# EAGLE design untitled (EAGLE 7.3.0)
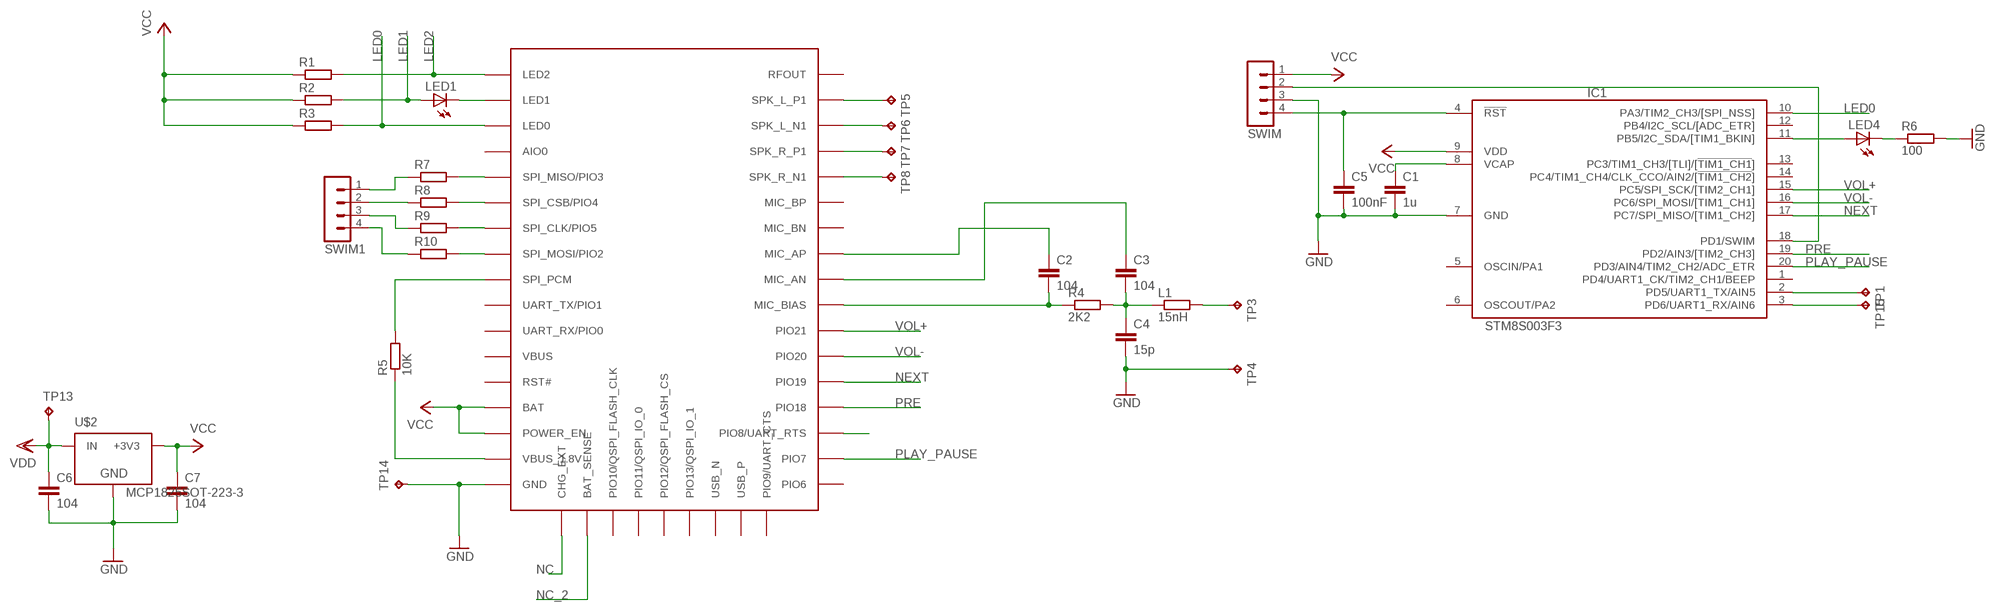
[diagram p0: schematic, sheet 1]

## Parts
C1  1u  C-EUC0805  [C0805]
C2  104  C-EUC0805  [C0805]
C3  104  C-EUC0805  [C0805]
C4  15p  C-EUC0805  [C0805]
C5  100nF  C-EUC0805  [C0805]
C6  104  C-EUC0805  [C0805]
C7  104  C-EUC0805  [C0805]
IC1  STM8S003F3  [TSSOP20]
L1  15nH  R-EU_R0603  [R0603]
LED1  LEDCHIPLED_0603  [CHIPLED_0603]
LED4  LEDCHIPLED_0603  [CHIPLED_0603]
R1  R-EU_R0805  [R0805]
R2  R-EU_R0805  [R0805]
R3  R-EU_R0805  [R0805]
R4  2K2  R-EU_R0805  [R0805]
R5  10K  R-EU_R0805  [R0805]
R6  100  R-EU_R0805  [R0805]
R7  R-EU_R0805  [R0805]
R8  R-EU_R0805  [R0805]
R9  R-EU_R0805  [R0805]
R10  R-EU_R0805  [R0805]
SWIM  MA04-1  [MA04-1]
SWIM1  MA04-1  [MA04-1]
TP1  TPB2,54  [B2,54]
TP3  TPB2,54  [B2,54]
TP4  TPB2,54  [B2,54]
TP5  TPB2,54  [B2,54]
TP6  TPB2,54  [B2,54]
TP7  TPB2,54  [B2,54]
TP8  TPB2,54  [B2,54]
TP13  TPB2,54  [B2,54]
TP14  TPB2,54  [B2,54]
TP15  TPB2,54  [B2,54]
U$1  F3188  [F3188]
U$2  MCP1825SOT-223-3  [SOT-223]

## Nets
GND: C1.2 C4.2 C5.2 C6.2 C7.2 IC1.7(GND) R6.2 SWIM.3 TP4.TP TP14.TP U$1.P$17(GND) U$2.2(GND)
LED0: IC1.10(PA3/TIM2_CH3/[SPI_NSS]) R3.2 U$1.P$3(LED0)
LED1: LED1.A R2.2
LED2: R1.2 U$1.P$1(LED2)
N$1: IC1.3(PD6/UART1_RX/AIN6) TP15.TP
N$5: IC1.2(PD5/UART1_TX/AIN5) TP1.TP
N$6: IC1.11(PB5/I2C_SDA/[TIM1_BKIN]) LED4.A
N$7: C2.2 R4.1 U$1.P$34(MIC_BIAS)
N$8: C3.2 C4.1 L1.1 R4.2
N$9: C3.1 U$1.P$35(MIC_AN)
N$10: C2.1 U$1.P$36(MIC_AP)
N$11: L1.2 TP3.TP
N$12: R5.1 U$1.P$16(VBUS_1.8V)
N$15: R5.2 U$1.P$9(SPI_PCM)
N$16: TP5.TP U$1.P$42(SPK_L_P1)
N$17: TP6.TP U$1.P$41(SPK_L_N1)
N$18: TP7.TP U$1.P$40(SPK_R_P1)
N$19: TP8.TP U$1.P$39(SPK_R_N1)
N$20: R7.2 U$1.P$5(SPI_MISO/PIO3)
N$21: R7.1 SWIM1.1
N$22: R9.2 U$1.P$7(SPI_CLK/PIO5)
N$23: R8.1 SWIM1.2
N$24: C1.1 IC1.8(VCAP)
N$26: C5.1 IC1.4(!RST) SWIM.4
N$27: U$1.P$29(PIO8/UART_RTS)
N$28: IC1.18(PD1/SWIM) SWIM.2
N$29: LED4.C R6.1
N$30: R8.2 U$1.P$6(SPI_CSB/PIO4)
N$31: R9.1 SWIM1.3
N$32: R10.2 U$1.P$8(SPI_MOSI/PIO2)
N$33: R10.1 SWIM1.4
N$34: LED1.C U$1.P$2(LED1)
NC: U$1.P$18(CHG_EXT)
NC_2: U$1.P$19(BAT_SENSE)
NEXT: IC1.17(PC7/SPI_MISO/[TIM1_CH2]) U$1.P$31(PIO19)
PLAY_PAUSE: IC1.20(PD3/AIN4/TIM2_CH2/ADC_ETR) U$1.P$28(PIO7)
PRE: IC1.19(PD2/AIN3/[TIM2_CH3]) U$1.P$30(PIO18)
VCC: C7.1 IC1.9(VDD) R1.1 R2.1 R3.1 SWIM.1 U$1.P$14(BAT) U$1.P$15(POWER_EN) U$2.3(+3V3)
VDD: C6.1 TP13.TP U$2.1(IN)
VOL+: IC1.15(PC5/SPI_SCK/[TIM2_CH1]) U$1.P$33(PIO21)
VOL-: IC1.16(PC6/SPI_MOSI/[TIM1_CH1]) U$1.P$32(PIO20)
Unconnected: IC1.1(PD4/UART1_CK/TIM2_CH1/BEEP) IC1.5(OSCIN/PA1) IC1.6(OSCOUT/PA2) IC1.12(PB4/I2C_SCL/[ADC_ETR]) IC1.13(PC3/TIM1_CH3/[TLI]/[!TIM1_CH1!]) IC1.14(PC4/TIM1_CH4/CLK_CCO/AIN2/[!TIM1_CH2!]) U$1.P$4(AIO0) U$1.P$10(UART_TX/PIO1) U$1.P$11(UART_RX/PIO0) U$1.P$13(RST#) U$1.P$20(PIO10/QSPI_FLASH_CLK) U$1.P$21(PIO11/QSPI_IO_0) U$1.P$22(PIO12/QSPI_FLASH_CS) U$1.P$23(PIO13/QSPI_IO_1) U$1.P$24(USB_N) U$1.P$25(USB_P) U$1.P$26(PIO9/UART_CTS) U$1.P$27(PIO6) U$1.P$37(MIC_BN) U$1.P$38(MIC_BP) U$1.P$43(RFOUT)

## Power pins joined to a net without a drawn wire
VBUS: U$1.P$12(VBUS)

## Library data of the parts
C1-C7 = rcl:C-EU: CAPACITOR, European symbol
IC1 = stm8:STM8S003: Value line, 16 MHz STM8S 8-bit MCU, 8 Kbytes Flash, 128 bytes data EEPROM, 10-bit ADC, 3 timers, UART, SPI, I2C
L1 R1-R10 = rcl:R-EU_: RESISTOR, European symbol
LED1 LED4 = led:LED: LED OSRAM: - CHIPLED LG R971, LG N971, LY N971, LG Q971, LY Q971, LO R971, LY R971 LH N974, LH R974 LS Q976, LO Q976, LY Q976 LO Q996 - Hyper CHIPLED LW Q18S LB Q993, LB Q99A, LB R99A - SideLED LS A670, LO A670, LY A670, LG A670, LP A670 LB A673, LV A673, LT A673, LW A673 LH A674 LY A675 LS A676, LA A676, LO A676, LY A676, LW A676 LS A679, LY A679, LG A679 - Hyper Micro SIDELED® LS Y876, LA Y876, LO Y876, LY Y876 LT Y87S - SmartLED LW L88C, LW L88S LB L89C, LB L89S, LG L890 LS L89K, LO L89K, LY L89K LS L896, LA L896, LO L896, LY L896 - TOPLED LS T670, LO T670, LY T670, LG T670, LP T670 LSG T670, LSP T670, LSY T670, LOP T670, LYG T670 LG T671, LOG T671, LSG T671 LB T673, LV T673, LT T673, LW T673 LH T674 LS T676, LA T676, LO T676, LY T676, LB T676, LH T676, LSB T676, LW T676 LB T67C, LV T67C, LT T67C, LS T67K, LO T67K, LY T67K, LW E67C LS E67B, LA E67B, LO E67B, LY E67B, LB E67C, LV E67C, LT E67C LW T67C LS T679, LY T679, LG T679 LS T770, LO T770, LY T770, LG T770, LP T770 LB T773, LV T773, LT T773, LW T773 LH T774 LS E675, LA E675, LY E675, LS T675 LS T776, LA T776, LO T776, LY T776, LB T776 LHGB T686 LT T68C, LB T68C - Hyper Mini TOPLED® LB M676 - Mini TOPLED Santana® LG M470 LS M47K, LO M47K, LY M47K Source: http://www.osram.convergy.de LUXEON: - LUMILED® LXK2-PW12-R00, LXK2-PW12-S00, LXK2-PW14-U00, LXK2-PW14-V00 LXK2-PM12-R00, LXK2-PM12-S00, LXK2-PM14-U00 LXK2-PE12-Q00, LXK2-PE12-R00, LXK2-PE12-S00, LXK2-PE14-T00, LXK2-PE14-U00 LXK2-PB12-K00, LXK2-PB12-L00, LXK2-PB12-M00, LXK2-PB14-N00, LXK2-PB14-P00, LXK2-PB14-Q00 LXK2-PR12-L00, LXK2-PR12-M00, LXK2-PR14-Q00, LXK2-PR14-R00 LXK2-PD12-Q00, LXK2-PD12-R00, LXK2-PD12-S00 LXK2-PH12-R00, LXK2-PH12-S00 LXK2-PL12-P00, LXK2-PL12-Q00, LXK2-PL12-R00 Source: www.luxeon.com KINGBRIGHT: KA-3528ASYC Source: www.kingbright.com
SWIM SWIM1 = con-lstb:MA04-1: PIN HEADER; OC_FARNELL: unknown; OC_NEWARK: unknown
TP1 TP3-TP8 TP13-TP15 = testpad:TP: Test pad
U$1 = f3188:F3188
U$2 = SteelCaveRobotics-Power:MCP1825: MCP1825 3.3v LDO Linear Regulator

## Board
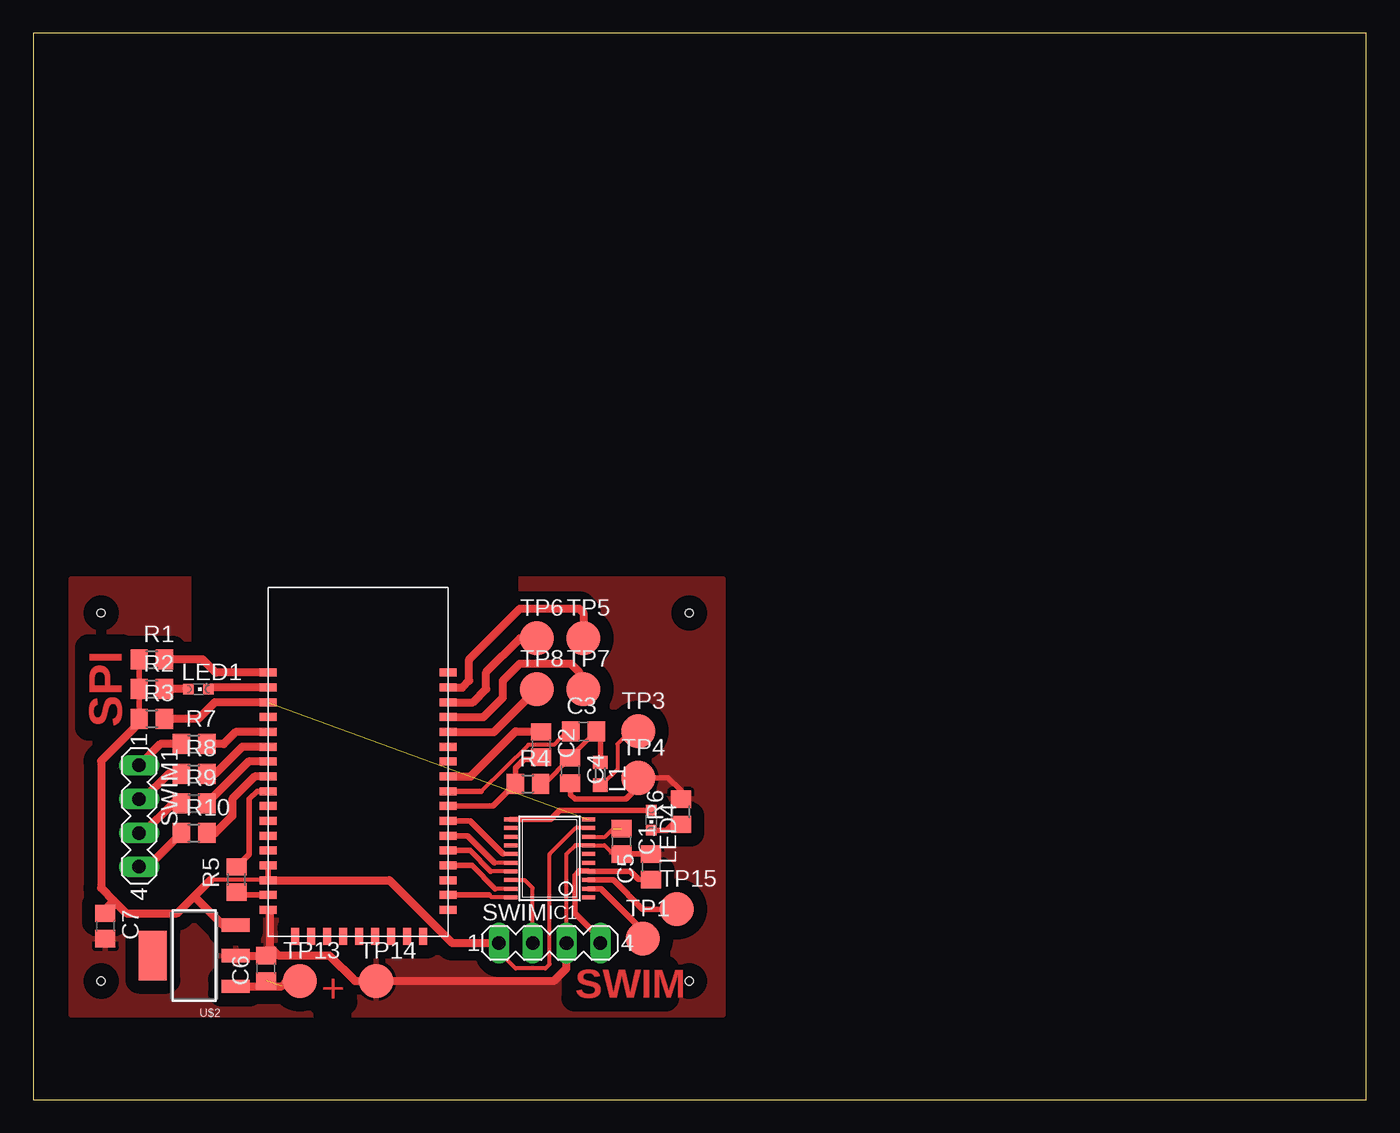
[diagram p1: board, top side]
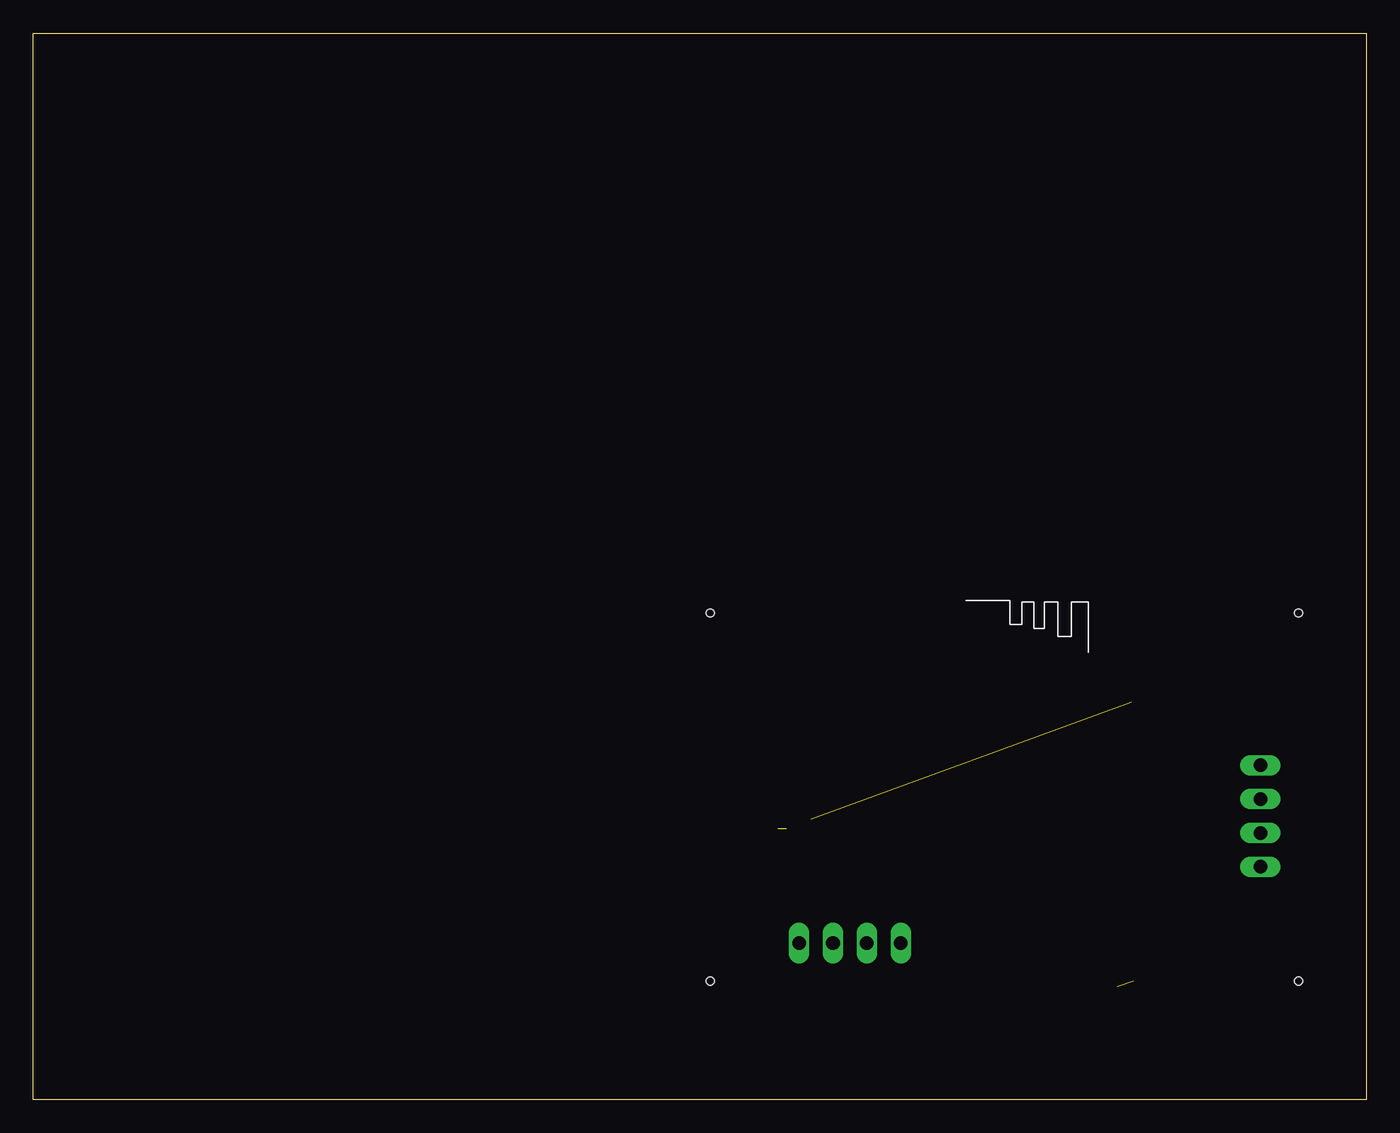
[diagram p2: board, bottom side, seen from below]

Size 100 x 80 mm. Coordinates in mm from the lower left corner, seen from the top.
Outline: 0,0 100,0 100,80 0,80 0,0
Copper layers (1*16): Top 0.035mm / dielectric 1.5mm / Bottom 0.035mm
Design rules "default": minimum track width 10mil, minimum drill 24mil, track to track 8mil, track to pad 8mil, pad to pad 8mil, via to via 8mil, smd to smd 8mil, copper to edge 40mil, drill to drill 8mil, minimum pad ring 10mil, minimum via ring 8mil, stop-mask expansion 4mil, vias tented up to drill 0mil, thermal gap 10mil
Holes 0.6 mm at 5.08,8.89 49.21,8.89 5.08,36.51 49.21,36.51

### Footprints (pad centres in the part's own frame; a part is rotated, then mirrored left to right if it is on the bottom)
C0805 = smd 1.3 x 1.5: 1 -0.95,0; 2 0.95,0
TSSOP20 = smd 0.305 x 0.991: 1 -2.925,-2.918; 2 -2.275,-2.918; 3 -1.625,-2.918; 4 -0.975,-2.918; 5 -0.325,-2.918; 6 0.325,-2.918; 7 0.975,-2.918; 8 1.625,-2.918; 9 2.275,-2.918; 10 2.925,-2.918; 11 2.925,2.918; 12 2.275,2.918; 13 1.625,2.918; 14 0.975,2.918; 15 0.325,2.918; 16 -0.325,2.918; 17 -0.975,2.918; 18 -1.625,2.918; 19 -2.275,2.918; 20 -2.925,2.918
R0603 = smd 1 x 1.1: 1 -0.85,0; 2 0.85,0
CHIPLED_0603 = smd 0.8 x 0.8: A 0,-0.75; C 0,0.75
R0805 = smd 1.3 x 1.5: 1 -0.95,0; 2 0.95,0
MA04-1 = drill 1.016 long: 1 -3.81,0; 2 -1.27,0; 3 1.27,0; 4 3.81,0
B2,54 = smd 2.54 x 2.54: TP 0,0
F3188 = smd 1.27 x 0.6: P$1 -6.5,7.9; P$2 -6.5,6.787; P$3 -6.5,5.675; P$4 -6.5,4.562; P$5 -6.5,3.45; P$6 -6.5,2.337; P$7 -6.5,1.225; P$8 -6.5,0.113; P$9 -6.5,-1; P$10 -6.5,-2.112; P$11 -6.5,-3.225; P$12 -6.5,-4.338; P$13 -6.5,-5.45; P$14 -6.5,-6.562; P$15 -6.5,-7.675; P$16 -6.5,-8.787; P$17 -6.5,-9.9; P$27 7,-9.9; P$28 7,-8.787; P$29 7,-7.675; P$30 7,-6.562; P$31 7,-5.45; P$32 7,-4.338; P$33 7,-3.225; P$34 7,-2.112; P$35 7,-1; P$36 7,0.113; P$37 7,1.225; P$38 7,2.337; P$39 7,3.45; P$40 7,4.562; P$41 7,5.675; P$42 7,6.787; P$43 7,7.9 | smd 0.6 x 1.27: P$18 -4.5,-11.9; P$19 -3.3,-11.9; P$20 -2.1,-11.9; P$21 -0.9,-11.9; P$22 0.3,-11.9; P$23 1.5,-11.9; P$24 2.7,-11.9; P$25 3.9,-11.9; P$26 5.1,-11.9
SOT-223 = smd 1 x 2.1: 1 -2.3,-3.1; 2 0,-3.1; 3 2.3,-3.1 | smd 3.7 x 2.1: 4 0,3.1

### Placement (x,y rotation side)
C1  44.13,19.37 270 top
C2  38.1,26.63 270 top
C3  41.27,27.62 0 top
C4  40.28,24.68 270 top
C5  46.35,17.46 90 top
C6  17.46,9.84 90 top
C7  5.4,13.02 270 top
IC1  38.73,18.1 90 top
L1  42.55,24.45 270 top
LED1  12.38,30.8 270 top
LED4  46.35,20.95 180 top
R1  8.89,33.02 0 top
R2  8.89,30.8 0 top
R3  8.89,28.57 0 top
R4  37.11,23.69 0 top
R5  15.24,16.51 90 top
R6  48.58,21.59 90 top
R7  12.06,26.67 0 top
R8  12.06,24.45 0 top
R9  12.06,22.23 0 top
R10  12.06,20 0 top
SWIM  38.73,11.75 0 top
SWIM1  7.94,21.27 270 top
TP1  45.72,12.06 0 top
TP3  45.4,27.62 0 top
TP4  45.4,24.13 0 top
TP5  41.27,34.61 0 top
TP6  37.78,34.61 0 top
TP7  41.27,30.8 0 top
TP8  37.78,30.8 0 top
TP13  20,8.89 0 top
TP14  25.72,8.89 0 top
TP15  48.26,14.29 0 top
U$1  24.13,24.13 0 top
U$2  12.06,10.79 90 top

### Tracks (layer width: path | path; a pad name or v marks a point on that pad's centre or on a via)
GND
  Top 0.305: SWIM.3 40.01,18.41 40.66,19.07 IC1.7 42.84,19.07 43.5,18.41 C1.2 | 44.77,18.41 C1.2
  Top 0.406: 45.4,23.5 TP4.TP 47.62,24.13 48.58,23.18 R6.2 | C4.2 40.32,23.69 40.32,22.86 40.64,22.54 44.45,22.54 45.4,23.5 | 45.4,23.5 45.72,23.81 | C1.2 C5.2
  Top 0.61: 17.78,11.43 18.41,10.79 22.23,10.79 24.13,8.89 TP14.TP 39.05,8.89 40.01,9.84 SWIM.3 | 17.78,11.43 17.78,14.08 U$1.P$17 | U$2.2 17.14,10.79 17.78,11.43
  pour Top (isolate 1.016): 2.86,39.05 51.75,39.05 51.75,6.35 2.86,6.35
LED0  (1 unrouted)
  Top 0.61: U$1.P$3 13.61,29.8 12.38,28.57 R3.2
LED1
  Top 0.61: 9.96,30.92 R2.2 LED1.A
LED2
  Top 0.61: U$1.P$1 13.69,32.03 12.7,33.02 R1.2
N$1
  Top 0.406: IC1.3 43.53,16.47 45.72,14.29 TP15.TP
N$4
  cutout Top: 12.06,39.05 12.06,33.02 18.73,33.02 18.73,13.02 41.27,13.02 41.27,33.34 36.2,33.34 36.2,39.05
N$5
  Top 0.406: IC1.2 42.6,15.82 45.72,12.7 TP1.TP
N$6
  Top 0.406: LED4.A 39.48,21.7 38.8,21.02 IC1.11
N$7
  Top 0.406: C2.2 37.91,25.52 36.83,25.52 36.19,24.88 R4.1 34.49,22.02 U$1.P$34
N$8
  Top 0.356: 38.34,23.69 C4.1 | 40.28,25.68 C3.2
  Top 0.406: R4.2 38.34,23.69 | C4.1 40.28,25.68 | L1.1 42.55,27.3 C3.2
N$9
  Top 0.305: 33.61,23.13 37.15,26.62 39.05,26.62 40.01,27.62 C3.1
  Top 0.406: U$1.P$35 33.61,23.13
N$10
  Top 0.406: 37.98,27.72 C2.1
  Top 0.61: U$1.P$36 32.81,24.24 36.2,27.62 38.06,27.62 C2.1
N$11
  Top 0.305: TP3.TP 44.77,27.62 43.81,26.67 43.81,24.77 42.65,23.6 L1.2
N$12
  Top 0.406: U$1.P$16 15.46,15.34 R5.1
N$15
  Top 0.406: U$1.P$9 16.78,23.13 16.19,22.54 16.19,18.41 R5.2
N$16
  Top 0.61: U$1.P$42 32.19,30.92 32.7,31.43 32.7,33.02 36.51,36.83 40.96,36.83 41.27,36.51 TP5.TP
N$17
  Top 0.61: U$1.P$41 32.98,29.8 33.97,30.8 33.97,32.07 36.51,34.61 TP6.TP
N$18
  Top 0.61: U$1.P$40 33.77,28.69 35.24,30.16 35.24,31.43 36.51,32.7 40.32,32.7 40.96,32.07 40.96,31.11 TP7.TP
N$19
  Top 0.61: U$1.P$39 34.56,27.58 TP8.TP
N$20
  Top 0.61: U$1.P$5 15.2,27.58 14.29,26.67 R7.2
N$21
  Top 0.61: R7.1 9.53,26.67 SWIM1.1
N$22
  Top 0.61: U$1.P$7 16.14,25.36 R9.2
N$23
  Top 0.61: SWIM1.2 8.26,22.54 10.16,24.45 R8.1
N$24  (1 unrouted)
  Top 0.305: 43.5,20.32 42.9,19.72 IC1.8
N$26
  Top 0.406: C5.1 45.4,16.51 44.79,17.12 IC1.4 41.63,17.14 40.96,17.14 40.64,16.83 40.64,13.97 42.55,12.06 SWIM.4
N$28
  Top 0.305: SWIM.2 37.47,15.88 36.87,16.47 IC1.18
N$29
  Top 0.406: LED4.C 47.51,20.2 47.94,20.64 R6.1
N$30
  Top 0.61: U$1.P$6 15.67,26.47 13.65,24.45 R8.2
N$31
  Top 0.61: SWIM1.3 8.26,20 10.48,22.23 R9.1
N$32
  Top 0.61: U$1.P$8 16.62,24.24 14.92,22.54 14.92,21.27 13.65,20 R10.2
N$33
  Top 0.61: SWIM1.4 8.57,17.46 R10.1
N$34
  Top 0.61: U$1.P$2 13.25,30.92 LED1.C
NEXT
  Top 0.305: IC1.17 34.31,17.12
  Top 0.406: U$1.P$31 32.76,18.68 34.31,17.12
PLAY_PAUSE
  Top 0.305: IC1.20 34.36,15.17 34.19,15.34
  Top 0.406: U$1.P$28 34.19,15.34
PRE
  Top 0.305: IC1.19 34.66,15.82
  Top 0.406: 34.66,15.82 32.91,17.57 U$1.P$30
VCC
  Top 0.305: IC1.9 40.69,20.37 38.73,18.41 38.73,10.16 38.42,9.84 36.2,9.84 34.92,11.11 | 13.34,16.51 17.57,16.51
  Top 0.406: U$1.P$14 U$1.P$15 17.57,16.51 | R1.1 R2.1 R3.1 7.94,28.26
  Top 0.61: U$1.P$15 26.73,16.45 31.43,11.75 SWIM.1 34.92,11.11 | 7.94,28.26 5.08,25.4 5.08,15.88 6.03,14.92 | 6.03,14.92 6.99,13.97 10.79,13.97 12.06,15.24 | 12.06,15.24 13.34,16.51 | U$2.3 14.21,13.1 12.06,15.24 | C7.1 5.08,13.65 5.08,13.97 6.03,14.92
VDD  (1 unrouted)
  Top 0.61: 19.61,8.49 TP13.TP 19.05,8.89 18.66,8.49 U$2.1
VOL+
  Top 0.305: IC1.15 35.23,18.42
  Top 0.406: 35.23,18.42 32.75,20.91 U$1.P$33
VOL-
  Top 0.305: IC1.16 34.62,17.77
  Top 0.406: U$1.P$32 32.59,19.79 34.62,17.77

### Text on the board
Top: SPI | SWIM | +